# EAGLE schematic mod.ad9850 (EAGLE 7.1.0)
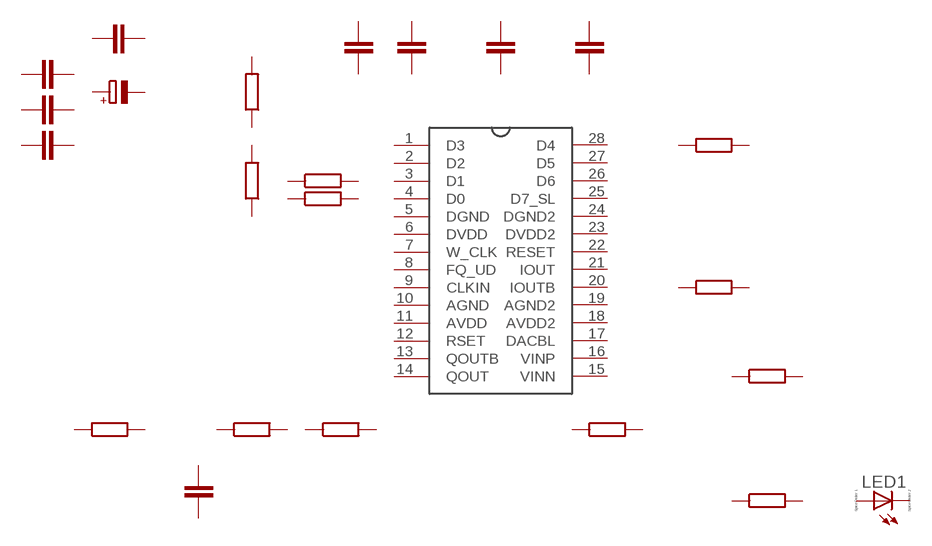
[diagram p0: schematic, sheet 1]

## Parts
LED1  LED_ESML0603  [LED_SML0603]
U$1  AD9850  [SSOP28]
Unconnected: LED1.A LED1.C U$1.1(D3) U$1.2(D2) U$1.3(D1) U$1.4(D0) U$1.5(DGND) U$1.6(DVDD) U$1.7(W_CLK) U$1.8(FQ_UD) U$1.9(CLKIN) U$1.10(AGND) U$1.11(AVDD) U$1.12(RSET) U$1.13(QOUTB) U$1.14(QOUT) U$1.15(VINN) U$1.16(VINP) U$1.17(DACBL) U$1.18(AVDD2) U$1.19(AGND2) U$1.20(IOUTB) U$1.21(IOUT) U$1.22(RESET) U$1.23(DVDD2) U$1.24(DGND2) U$1.25(D7_SL) U$1.26(D6) U$1.27(D5) U$1.28(D4)

## Library data of the parts
LED1 = eagle-ltspice:LED_E: LED Source: http://www.osram.convergy.de Source: www.luxeon.com Source: www.kingbright.com; SPICEMODEL: NONE; SPICEPREFIX: D; SPICETYPE: diode
U$1 = ad9850:AD9850: CMOS, 125 MHz Complete DDS Synthesizer